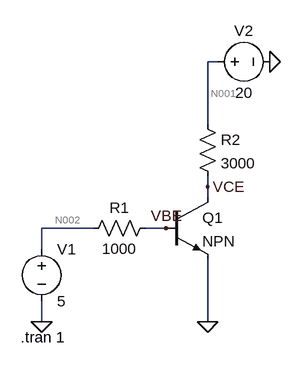
[diagram p0: schematic circuito2.asc]
circuito2.asc, the LTspice schematic file:
Version 4.1
SHEET 1 880 680
WIRE 288 -160 272 -160
WIRE 272 -64 272 -160
WIRE 272 32 272 16
WIRE 272 48 272 32
WIRE 96 96 16 96
WIRE 208 96 176 96
WIRE 16 128 16 96
WIRE 16 240 16 208
WIRE 272 240 272 144
FLAG 272 240 0
FLAG 368 -160 0
FLAG 16 240 0
FLAG 272 32 VCE
FLAG 208 96 VBE
SYMBOL voltage 16 112 R0
WINDOW 123 0 0 Left 0
WINDOW 39 0 0 Left 0
SYMATTR InstName V1
SYMATTR Value 5
SYMBOL res 192 80 R90
WINDOW 0 0 56 VBottom 2
WINDOW 3 32 56 VTop 2
SYMATTR InstName R1
SYMATTR Value 1000
SYMBOL npn 208 48 R0
SYMATTR InstName Q1
SYMBOL res 256 -80 R0
SYMATTR InstName R2
SYMATTR Value 3000
SYMBOL voltage 272 -160 R270
WINDOW 0 32 56 VTop 2
WINDOW 3 -32 56 VBottom 2
WINDOW 123 0 0 Left 0
WINDOW 39 0 0 Left 0
SYMATTR InstName V2
SYMATTR Value 20
TEXT -16 264 Left 2 !.tran 1

The netlist it stands for:
* circuito2.asc
V1 N002 0 5
R1 VBE N002 1000
Q1 VCE VBE 0 0 NPN
R2 N001 VCE 3000
V2 N001 0 20
.model NPN NPN
.model PNP PNP
.lib standard.bjt
.tran 1
.backanno
.end

* Results of the author's LTspice run, read from the files saved beside the schematic
* Operating Point, zero values left out:
*   V(vbe) = 843.7 mV
*   V(n001) = 20 V
*   V(n002) = 5 V
*   V(vce) = 33.56 mV
*   I(V1) = -4.156 mA
*   Ic(Q1) = 6.655 mA
*   Ib(Q1) = 4.156 mA
*   Ie(Q1) = -10.81 mA
*   I(V2) = -6.655 mA
*   I(R2) = 6.655 mA
*   I(R1) = -4.156 mA
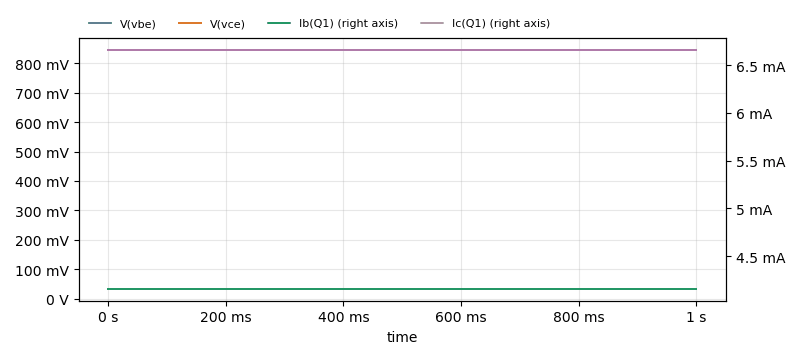
[diagram p1: Transient Analysis of circuito2.asc, plotted from the saved traces]
* Transient Analysis, 1 run:
*   V(vbe): min 843.7 mV, max 843.7 mV, average 843.7 mV, rms 843.7 mV, last 843.7 mV
*   V(vce): min 33.56 mV, max 33.56 mV, average 33.56 mV, rms 33.56 mV, last 33.56 mV
*   Ib(Q1): min 4.156 mA, max 4.156 mA, average 4.156 mA, rms 4.156 mA, last 4.156 mA
*   Ic(Q1): min 6.655 mA, max 6.655 mA, average 6.655 mA, rms 6.655 mA, last 6.655 mA